# EAGLE schematic BrewPi LCD Shield (EAGLE 9.6.2)
COMPANY: BrewPi Remix; ENGINEER: @LBussy; MANAGER: @Cadibrewer; REVIEW: @day_trippr; SCH_REV: 1.3.1a; WEBSITE: https://www.brewpiremix.com
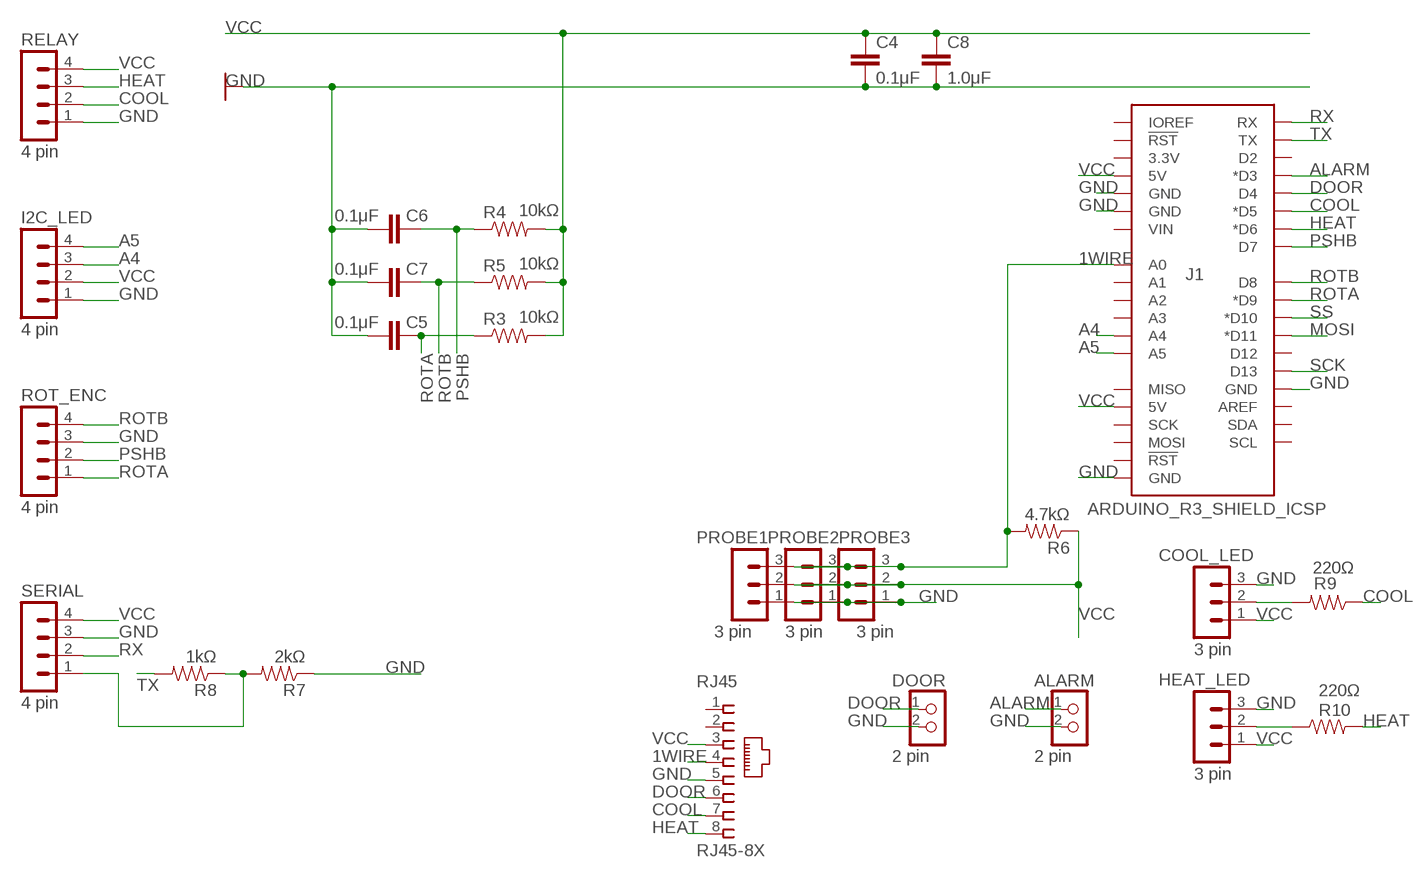
[diagram p0: schematic, sheet 1]

## Parts
ALARM  2 pin  HEADER02-1  [HEADER02-1]
C4  0.1μF  CAPKIT  [CAP-PTH-SMALL-KIT]
C5  0.1μF  CAPKIT  [CAP-PTH-SMALL-KIT]
C6  0.1μF  CAPKIT  [CAP-PTH-SMALL-KIT]
C7  0.1μF  CAPKIT  [CAP-PTH-SMALL-KIT]
C8  1.0μF  CAPKIT  [CAP-PTH-SMALL-KIT]
COOL_LED  3 pin  HEADER03-1  [HEADER03-1]
DOOR  2 pin  HEADER02-1  [HEADER02-1]
HEAT_LED  3 pin  HEADER03-1  [HEADER03-1]
I2C_LED  4 pin  HEADER04-1  [HEADER04-1]
J1  ARDUINO_R3_SHIELD_ICSP  [UNO_R3_SHIELD_ICSP]
PROBE1  3 pin  HEADER03-1  [HEADER03-1]
PROBE2  3 pin  HEADER03-1  [HEADER03-1]
PROBE3  3 pin  HEADER03-1  [HEADER03-1]
R3  10kΩ  RESISTORAXIAL-0.3  [AXIAL-0.3]
R4  10kΩ  RESISTORAXIAL-0.3  [AXIAL-0.3]
R5  10kΩ  RESISTORAXIAL-0.3  [AXIAL-0.3]
R6  4.7kΩ  RESISTORAXIAL-0.3  [AXIAL-0.3]
R7  2kΩ  RESISTORAXIAL-0.3  [AXIAL-0.3]
R8  1kΩ  RESISTORAXIAL-0.3  [AXIAL-0.3]
R9  220Ω  RESISTORAXIAL-0.3  [AXIAL-0.3]
R10  220Ω  RESISTORAXIAL-0.3  [AXIAL-0.3]
RELAY  4 pin  HEADER04-1  [HEADER04-1]
RJ45  RJ45-8X  [RJ45-NO-SHIELD]
ROT_ENC  4 pin  HEADER04-1  [HEADER04-1]
SERIAL  4 pin  HEADER04-1  [HEADER04-1]

## Nets
1WIRE: J1.A0 PROBE1.3 PROBE2.3 PROBE3.3 R6.P$2 RJ45.4
A4: I2C_LED.3 J1.A4
A5: I2C_LED.4 J1.A5
ALARM: ALARM.1 J1.D3(*D3)
COOL: J1.D5(*D5) R9.P$1 RELAY.2 RJ45.7
DOOR: DOOR.1 J1.D4 RJ45.6
GND: ALARM.2 C4.2 C5.2 C6.2 C7.2 C8.2 COOL_LED.3 DOOR.2 HEAT_LED.3 I2C_LED.1 J1.GND@0(GND) J1.GND@1(GND) J1.GND@2(GND) J1.GND_ICSP(GND) PROBE1.1 PROBE2.1 PROBE3.1 R7.P$1 RELAY.1 RJ45.5 ROT_ENC.3 SERIAL.3
HEAT: J1.D6(*D6) R10.P$2 RELAY.3 RJ45.8
MOSI: J1.D11(*D11)
N$3: R7.P$2 R8.P$1 SERIAL.1
N$4: COOL_LED.2 R9.P$2
N$8: HEAT_LED.2 R10.P$1
PSHB: C6.1 J1.D7 R4.P$1 ROT_ENC.2
ROTA: C5.1 J1.D9(*D9) R3.P$1 ROT_ENC.1
ROTB: C7.1 J1.D8 R5.P$1 ROT_ENC.4
RX: J1.RX SERIAL.2
SCK: J1.D13
SS: J1.D10(*D10)
TX: J1.TX R8.P$2
VCC: C4.1 C8.1 COOL_LED.1 HEAT_LED.1 I2C_LED.2 J1.5V J1.5V_ICSP(5V) PROBE1.2 PROBE2.2 PROBE3.2 R3.P$2 R4.P$2 R5.P$2 R6.P$1 RELAY.4 RJ45.3 SERIAL.4
Unconnected: J1.3.3V J1.A1 J1.A2 J1.A3 J1.AREF J1.D2 J1.D12 J1.IOREF J1.MISO J1.MOSI J1.RES(!RST!) J1.RST_ICSP(!RST!) J1.SCK J1.SCL J1.SDA J1.VIN RJ45.1 RJ45.2

## Library data of the parts
ALARM DOOR = LBussy:HEADER02-1: PIN HEADER
C4-C8 = SparkFun-Capacitors:CAP: Capacitor Standard 0603 ceramic capacitor, and 0.1" leaded capacitor.
COOL_LED HEAT_LED PROBE1-PROBE3 = LBussy:HEADER03-1: PIN HEADER; OC_FARNELL: unknown; OC_NEWARK: unknown
I2C_LED RELAY ROT_ENC SERIAL = LBussy:HEADER04-1: PIN HEADER; OC_FARNELL: unknown; OC_NEWARK: unknown
J1 = SparkFun-Boards:ARDUINO_R3_SHIELD_ICSP: Arduino R3 Shield Footprint w/ 6-pin (2x3) ICSP Header
R3-R10 = SparkFun-Passives:RESISTOR: Resistor Basic schematic elements and footprints for 0603, 1206, and PTH resistors.
RJ45 = con-tycoelectronics:RJ45: CORCOM Modular RJ Jacks No Shield Source: www.tycoelectronics.com .. ENG_DS_1654001_1099_RJ_L_0507.pdf; MPN: RJ45-8X; OC_FARNELL: unknown; OC_NEWARK: 16R6101